# Altium schematic sheet Mech_Interface_Port.SchDoc: Mech_Interface_Port
size Letter; Author: Nicholas J. Sorensen, and Erik F. Halliwell; Engineer: Nicholas J. Sorensen, and Erik F. Halliwell; DocumentNumber: 7; SheetNumber: 7; SheetTotal: 8
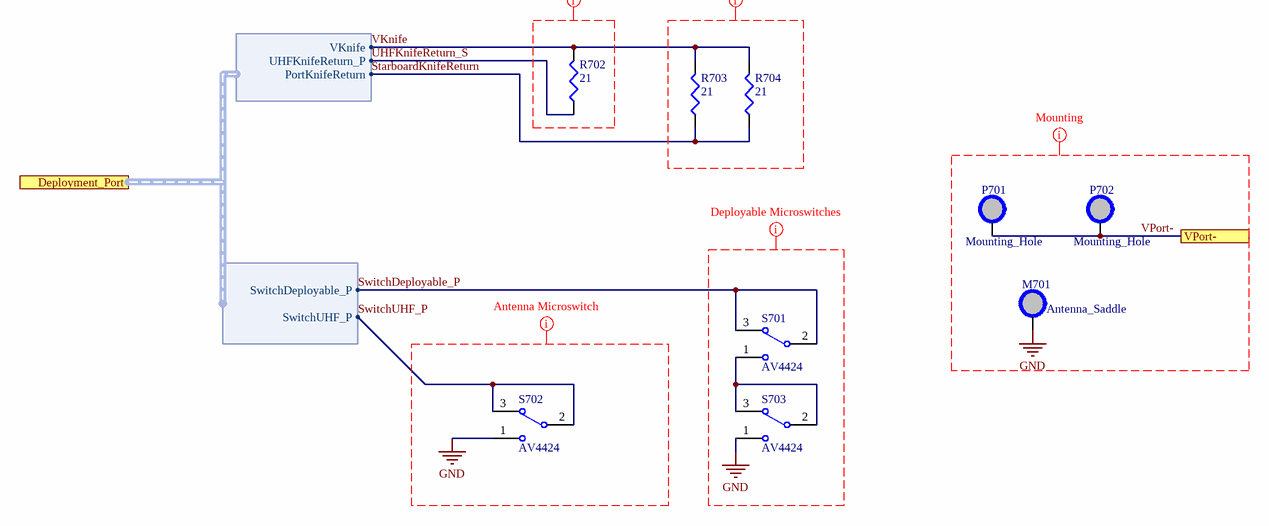
[diagram p0: Mech_Interface_Port.SchDoc]

## Parts
M701  Antenna_Saddle  [ANTENNA_SADDLE]
P701  Mounting_Hole  [DEPHINGE_MOUNTING_HOLE_BODY]
P702  Mounting_Hole  [DEPHINGE_MOUNTING_HOLE_BODY]
R702  value 21  [VSH-CPF1]  (hidden comment: Res3)
R703  value 21  [VSH-CPF1]  (hidden comment: Res3)
R704  value 21  [VSH-CPF1]  (hidden comment: Res3)
S701  AV4424  [PANA-AV4424]
S702  AV4424  [PANA-AV4424]
S703  AV4424  [PANA-AV4424]

## Ports
Deployment_Port (harness Deployment_Port), VPort-

## Harnesses
Deployment_Port: UHFKnifeReturn_P, VKnife, PortKnifeReturn
Deployment_Port: SwitchDeployable_P, SwitchUHF_P

## Nets
GND: M701.1 S702.1(NO) S703.1(NO)
StarboardKnifeReturn: R703.1 R704.1 ; port Deployment_Port.PortKnifeReturn
SwitchDeployable_P: S701.2(COM) S701.3(NC) ; port Deployment_Port.SwitchDeployable_P
SwitchUHF_P: S702.2(COM) S702.3(NC) ; port Deployment_Port.SwitchUHF_P
UHFKnifeReturn_S: R702.1 ; port Deployment_Port.UHFKnifeReturn_P
VKnife: R702.2 R703.2 R704.2 ; port Deployment_Port.VKnife
VPort-: P701.1 P702.1 ; port VPort-
NetS701_1: S701.1(NO) S703.2(COM) S703.3(NC)

## Layout directives
mark named Deployable Burnwire Knives: (no net found under the mark)
mark named Deployable Microswitches: GND
mark named Antenna Burnwire Knife: (no net found under the mark)
mark named Antenna Microswitch: GND
mark named Mounting: GND, VPort-

## Notes on the sheet
- (the "License"); you may not use or redistribute this file except in compliance with the License. You
- This file and the information within it are licensed under the terms of the Apache License, Version 2.0
- Copyright
- Unless required by applicable law or agreed to in writing, content distributed under the License is
- distributed on an "AS IS" BASIS, WITHOUT WARRANTIES OR CONDITIONS OF ANY KIND,
- either express or implied. See the License for the specific language governing permissions and
- limitations under the License.
- may obtain a copy of the License at:
- http://www.apache.org/licenses/LICENSE-2.0
- Title
- Size:
- Date:
- Letter
- Number:
- Time:
- Revision:
- Sheet
- of
- University of Alberta
- Deptartment of Electrical
- and Computer Engineering
- Edmonton AB, Canada
- T6G 1H9
- File:

## Library data of the parts
M701 = PXX-ABS-00001: Manufacturer Part Number: Custom; Index: 1; Designator: M?; Part Number: PXX-ABS-00001; Supplier 1: Digi-key; Publisher: AlbertaSat; LatestRevisionNote: ...
P701 P702 = PXX-ABS-00004: Manufacturer Part Number: Custom; Index: 4; Part Number: PXX-ABS-00004; Supplier 1: Digi-key; Publisher: AlbertaSat; LatestRevisionNote: ...
R702-R704 = PR-VSH-00317: 21 Ohms ±1% 1W Through Hole Resistor Axial Flame Proof, Moisture Resistant, Safety Metal Film; Manufacturer Part Number: CPF121R000FKEE6; Index: 317; Designator: R?; Temperature Coefficient: ±100ppm/°C; Published: 2/27/2020; LatestRevisionDate: 2/27/2020; LatestRevisionNote: ...; PackageReference: VSH-CPF1; Publisher: AlbertaSat; PackageDescription: Chip Resistor; Part Number: PR-VSH-00317; Supplier Part Number 1: CPF21.0CCT-ND; Supplier 1: Digi-key; Supplier Link: #https://www.digikey.ca/product-detail/en/vishay-dale/CPF121R000FKEE6/CPF21.0CCT-ND/2713126#; Tolerance: ±1%; Power - Rated: 1W
S701-S703 = 20035: SWITCH SNAP ACT SPDT 500MA 30V; Part Number: 20035; Manufacturer Part Number: AV4424; Supplier Part Number 1: 255-3743-ND; Supplier 1: Digi-Key; Supplier Link: #https://www.digikey.com/product-detail/en/panasonic-electric-works/AV4424/255-3743-ND/646766#